# Altium schematic sheet cable.SchDoc
size C
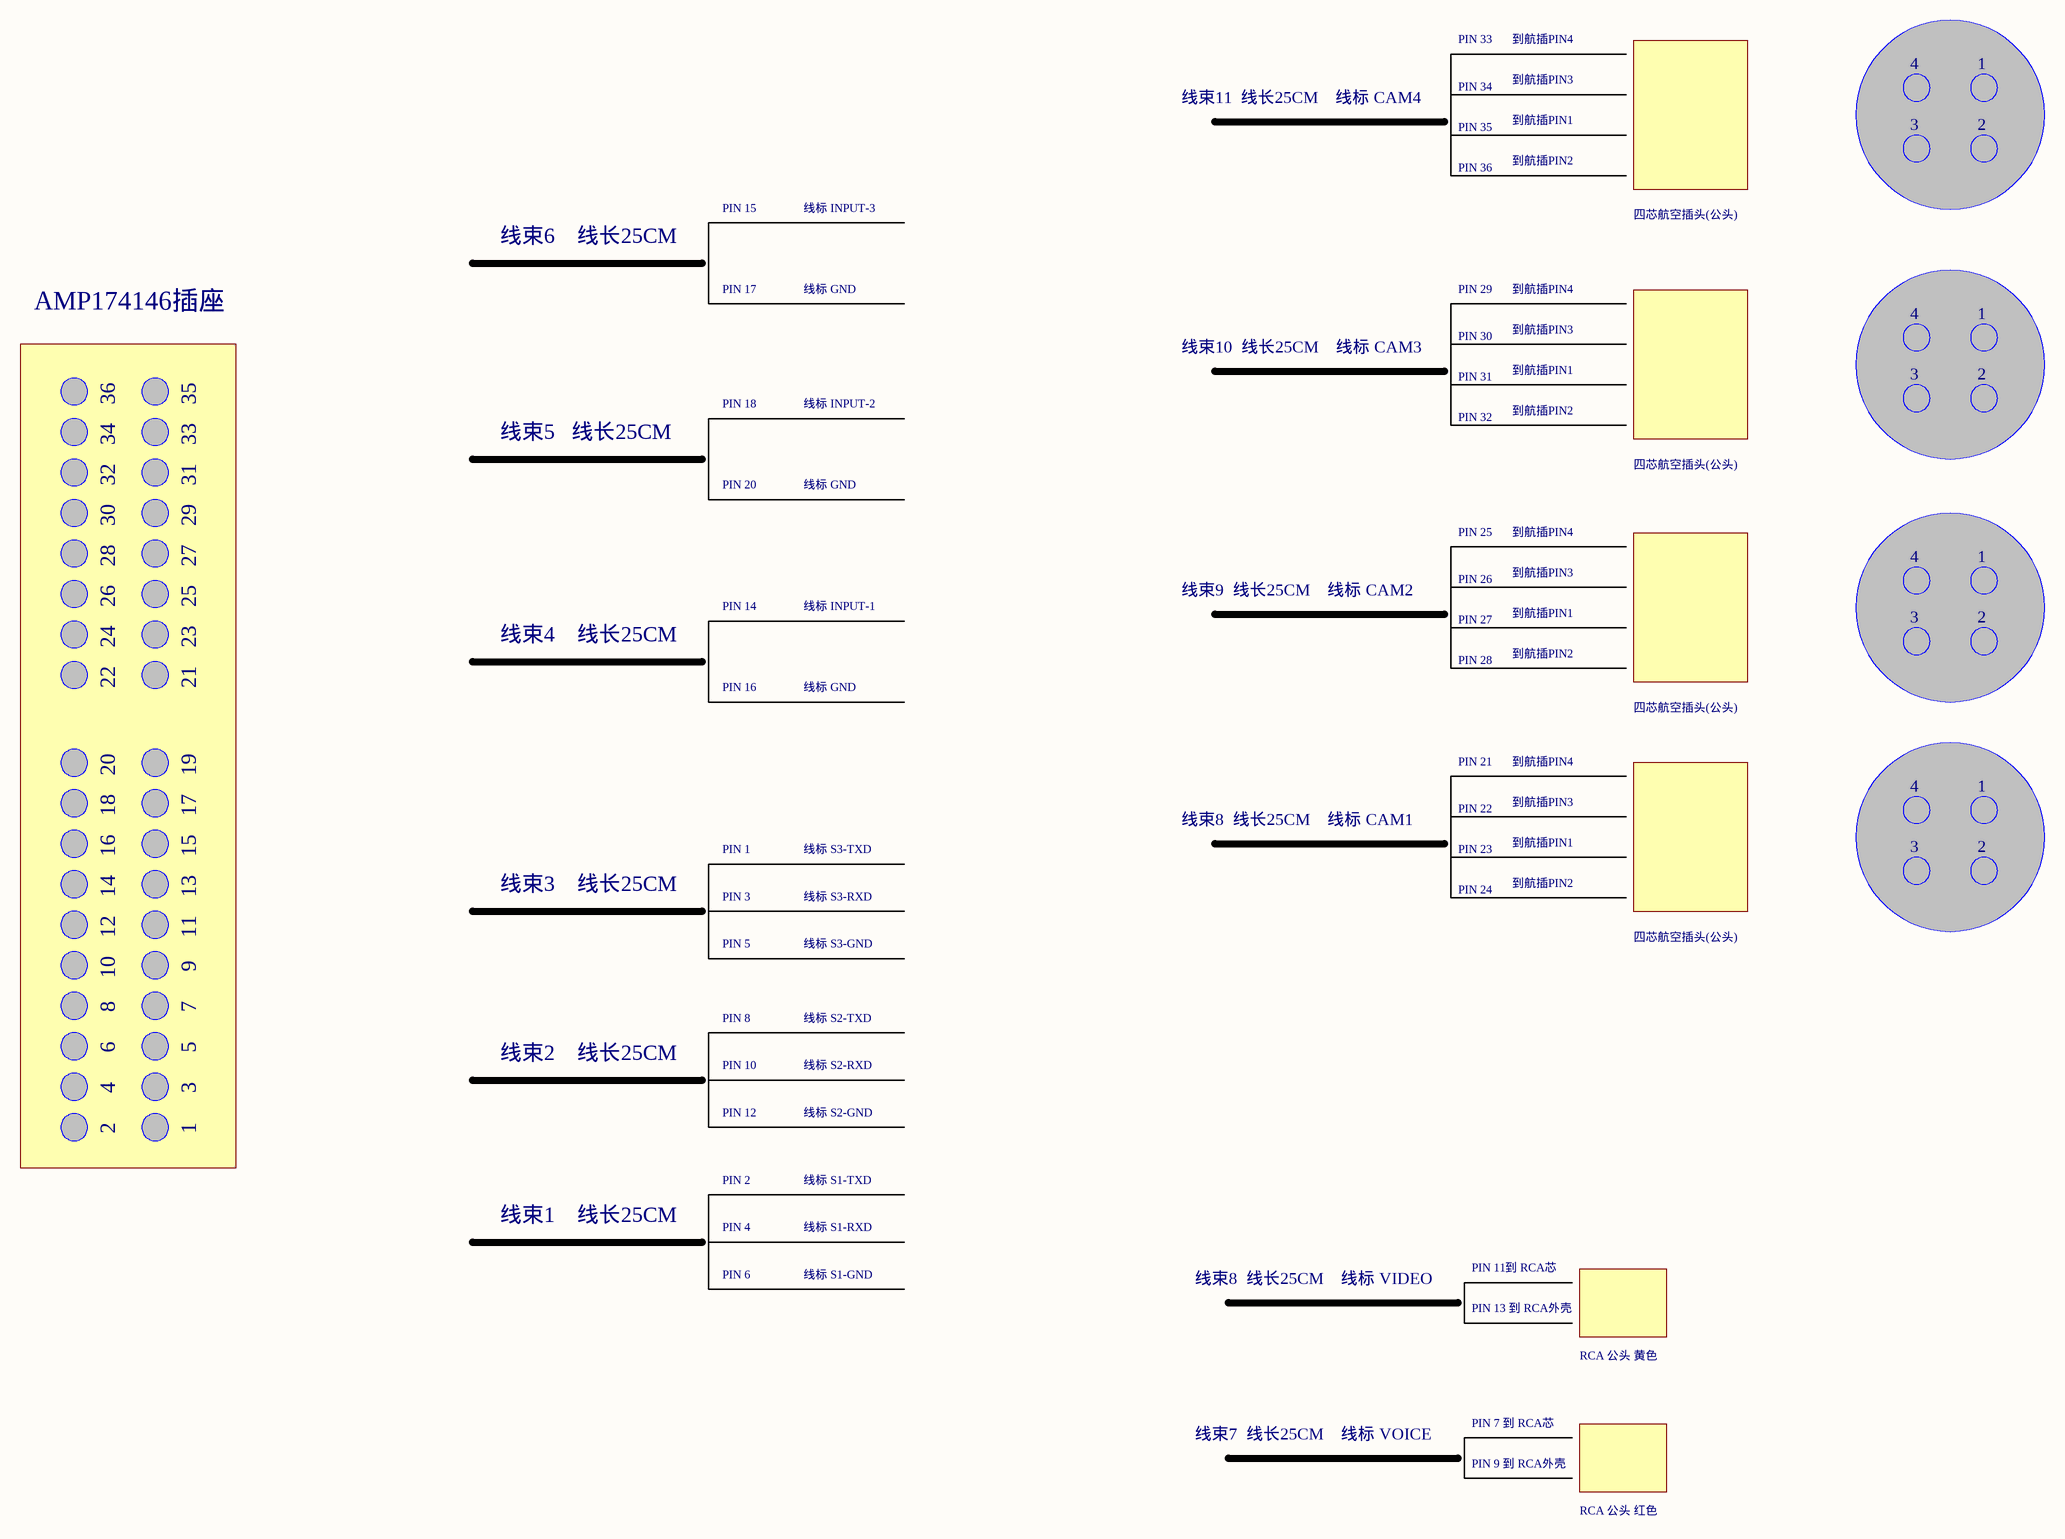
[diagram p0: cable.SchDoc]

## Notes on the sheet
- PIN 33
- 到航插PIN4
- 线束11  线长25CM　线标 CAM4
- PIN 34
- 到航插PIN3
- 4
- 1
- PIN 35
- PIN 36
- 到航插PIN1
- 到航插PIN2
- 3
- 2
- 线束6    线长25CM
- PIN 15
- 线标 INPUT-3
- 四芯航空插头(公头)
- AMP174146插座
- PIN 17
- 线标 GND
- PIN 29
- 线束10  线长25CM　线标 CAM3
- PIN 30
- PIN 31
- 34
- 36
- 33
- 35
- 线束5   线长25CM
- PIN 18
- 线标 INPUT-2
- PIN 32
- 30
- 32
- 29
- 31
- PIN 20
- 28
- 27
- 线束9  线长25CM　线标 CAM2
- PIN 25
- PIN 26
- 24
- 26
- 23
- 25
- 线束4    线长25CM
- PIN 14
- 线标 INPUT-1
- PIN 27
- 22
- 21
- PIN 16
- PIN 28
- 20
- 19
- PIN 21
- 16
- 18
- 15
- 17
- PIN 1
- 线标 S3-TXD
- 线束8  线长25CM　线标 CAM1
- PIN 22
- PIN 23
- 14
- 13
- 线束3    线长25CM
- PIN 3
- 线标 S3-RXD
- PIN 24
- 10
- 12
- 9
- 11
- PIN 5
- 线标 S3-GND
- 6
- 8
- 5
- 7
- 线束2    线长25CM
- PIN 8
- 线标 S2-TXD
- PIN 10
- PIN 12
- 线标 S2-RXD
- 线标 S2-GND
- PIN 2
- 线标 S1-TXD
- 线束1    线长25CM
- PIN 4
- 线标 S1-RXD
- PIN 11到 RCA芯
- PIN 6
- 线标 S1-GND
- 线束8  线长25CM　线标 VIDEO
- PIN 13 到 RCA外壳
- RCA 公头 黄色
- 线束7  线长25CM　线标 VOICE
- PIN 7 到 RCA芯
- PIN 9 到 RCA外壳
- RCA 公头 红色